# EAGLE design atmega16_generalpurpose_board (EAGLE 7.1.0)
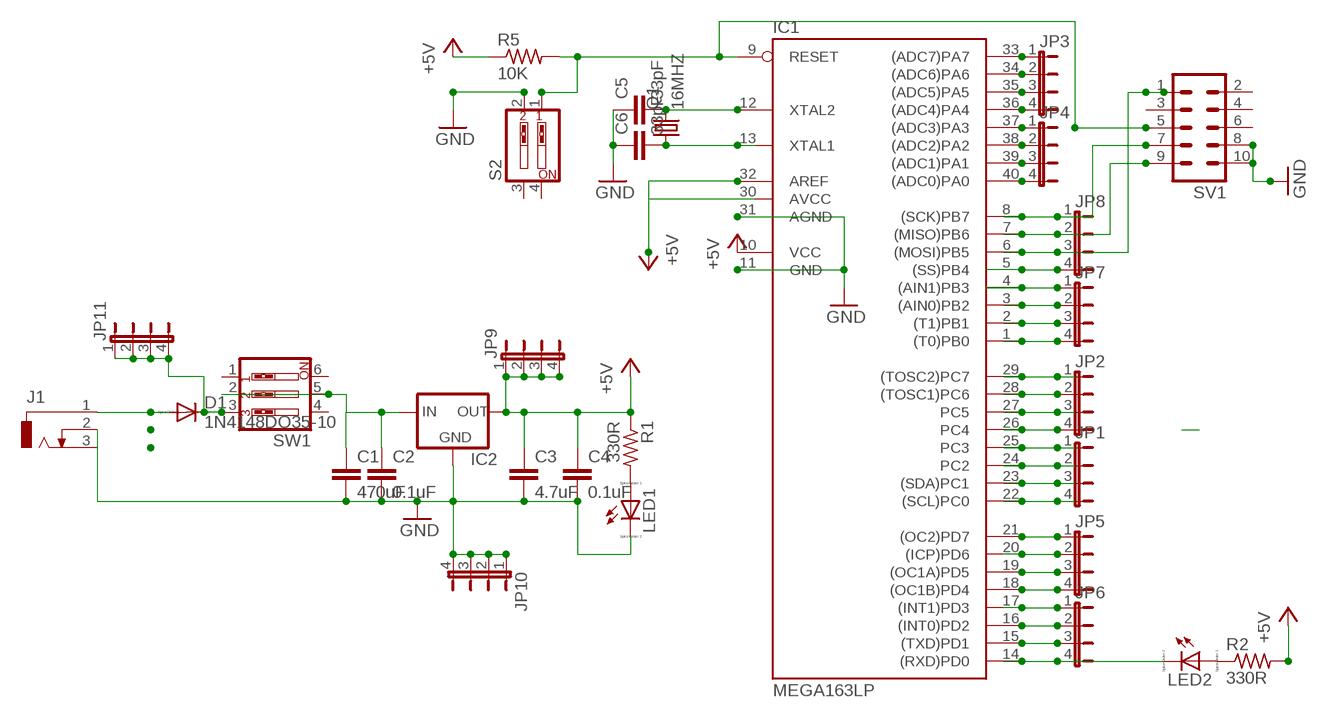
[diagram p0: schematic, sheet 1]

## Parts
C1  470uF  C2.5/4  [C2.5-4]
C2  0.1uF  C2.5/4  [C2.5-4]
C3  4.7uF  C2.5/4  [C2.5-4]
C4  0.1uF  C2.5/4  [C2.5-4]
C5  33pF  C2.5/4  [C2.5-4]
C6  33pF  C2.5/4  [C2.5-4]
D1  1N4148DO35-10  [DO35-10]
IC1  MEGA163LP  [DIL40]
IC2  78XXS  [78XXS]
J1  DCJ0303  [DCJ0303]
JP1  JP4E  [JP4]
JP2  JP4E  [JP4]
JP3  JP4E  [JP4]
JP4  JP4E  [JP4]
JP5  JP4E  [JP4]
JP6  JP4E  [JP4]
JP7  JP4E  [JP4]
JP8  JP4E  [JP4]
JP9  JP4E  [JP4]
JP10  JP4E  [JP4]
JP11  JP4E  [JP4]
LED1  LED_ELD260  [LED_LD260]
LED2  LED_ELD260  [LED_LD260]
Q1  16MHZ  CRYSTALHC49U-V  [HC49U-V]
R1  330R  R-US_0204/7  [0204/7]
R2  330R  R-US_0204/7  [0204/7]
R5  10K  R-US_0204/7  [0204/7]
S2  SW_DIP-2  [EDG-02]
SV1  MA05-2  [MA05-2]
SW1  SW_DIP-3  [EDG-03]

## Nets
+5V: C3.1 C4.1 IC1.10(VCC) IC1.32(AREF) IC2.OUT JP9.1 JP9.2 JP9.3 JP9.4 R1.1 R2.2 R5.1
GND: C1.2 C2.2 C3.2 C4.2 C5.1 C6.1 IC1.11(GND) IC1.31(AGND) IC2.GND J1.2 J1.3 JP10.1 JP10.2 JP10.3 JP10.4 LED1.K(C) S2.2 SV1.8 SV1.10
N$1: D1.A J1.1
N$2: IC1.29((TOSC2)PC7) JP2.1
N$3: C5.2 IC1.12(XTAL2) Q1.2
N$4: C6.2 IC1.13(XTAL1) Q1.1
N$5: LED1.A R1.2
N$6: IC1.9(RESET) R5.2 S2.1 SV1.5
N$7: IC1.21((OC2)PD7) JP5.1
N$8: D1.C JP11.1 JP11.2 JP11.3 JP11.4 SW1.3
N$9: C1.1 C2.1 IC2.IN SW1.2 SW1.5
N$10: IC1.1((T0)PB0) JP7.4
N$11: IC1.2((T1)PB1) JP7.3
N$12: IC1.3((AIN0)PB2) JP7.2
N$13: IC1.4((AIN1)PB3) JP7.1
N$14: IC1.17((INT1)PD3) JP6.1
N$15: IC1.20((ICP)PD6) JP5.2
N$16: IC1.5((SS)PB4) JP8.4
N$17: IC1.28((TOSC1)PC6) JP2.2
N$18: IC1.27(PC5) JP2.3
N$19: IC1.26(PC4) JP2.4
N$20: IC1.25(PC3) JP1.1
N$21: IC1.24(PC2) JP1.2
N$22: IC1.23((SDA)PC1) JP1.3
N$23: IC1.22((SCL)PC0) JP1.4
N$24: IC1.6((MOSI)PB5) JP8.3 SV1.1
N$25: IC1.7((MISO)PB6) JP8.2 SV1.9
N$26: IC1.8((SCK)PB7) JP8.1 SV1.7
N$27: IC1.14((RXD)PD0) JP6.4 LED2.K(C)
N$28: IC1.19((OC1A)PD5) JP5.3
N$29: IC1.33((ADC7)PA7) JP3.1
N$30: IC1.34((ADC6)PA6) JP3.2
N$31: IC1.35((ADC5)PA5) JP3.3
N$32: IC1.36((ADC4)PA4) JP3.4
N$33: IC1.37((ADC3)PA3) JP4.1
N$34: IC1.38((ADC2)PA2) JP4.2
N$35: IC1.39((ADC1)PA1) JP4.3
N$36: IC1.40((ADC0)PA0) JP4.4
N$37: LED2.A R2.1
N$38: IC1.18((OC1B)PD4) JP5.4
N$39: IC1.16((INT0)PD2) JP6.2
N$40: IC1.15((TXD)PD1) JP6.3
Unconnected: S2.3 S2.4 SV1.2 SV1.3 SV1.4 SV1.6 SW1.1 SW1.4 SW1.6

## Power pins joined to a net without a drawn wire
AVCC: IC1.30(AVCC)

## Library data of the parts
C1-C6 = capacitor-wima:C: CAPACITOR naming: grid - package width
D1 = diode:1N4148: DIODE high speed (Philips)
IC1 = atmel:MEGA163*P: MICROCONTROLLER 16 Kbytes FLASH 1 Kbytes EEPROM 1 Kbytes SRAM UART 8-channel 10 bit ADC hardware multiplier Source: avr.lbr; OC_FARNELL: unknown; OC_NEWARK: unknown
IC2 = v-reg:78XXS: VOLTAGE REGULATOR
J1 = con-jack:DCJ0303: DC POWER JACK Source: DCJ0303.pdf; OC_FARNELL: unknown; OC_NEWARK: unknown
JP1-JP11 = jumper:JP4E: JUMPER
LED1 LED2 = eagle-ltspice:LED_E: LED Source: http://www.osram.convergy.de Source: www.luxeon.com Source: www.kingbright.com; SPICEMODEL: NONE; SPICEPREFIX: D; SPICETYPE: diode
Q1 = crystal:CRYSTAL: CRYSTAL; OC_FARNELL: 1666969; OC_NEWARK: unknown
R1 R2 R5 = resistor:R-US_: RESISTOR, American symbol
S2 = special:SW_DIP-2: DIP SWITCH
SV1 = con-lstb:MA05-2: PIN HEADER; OC_FARNELL: unknown; OC_NEWARK: unknown
SW1 = special:SW_DIP-3: DIP SWITCH

## Board
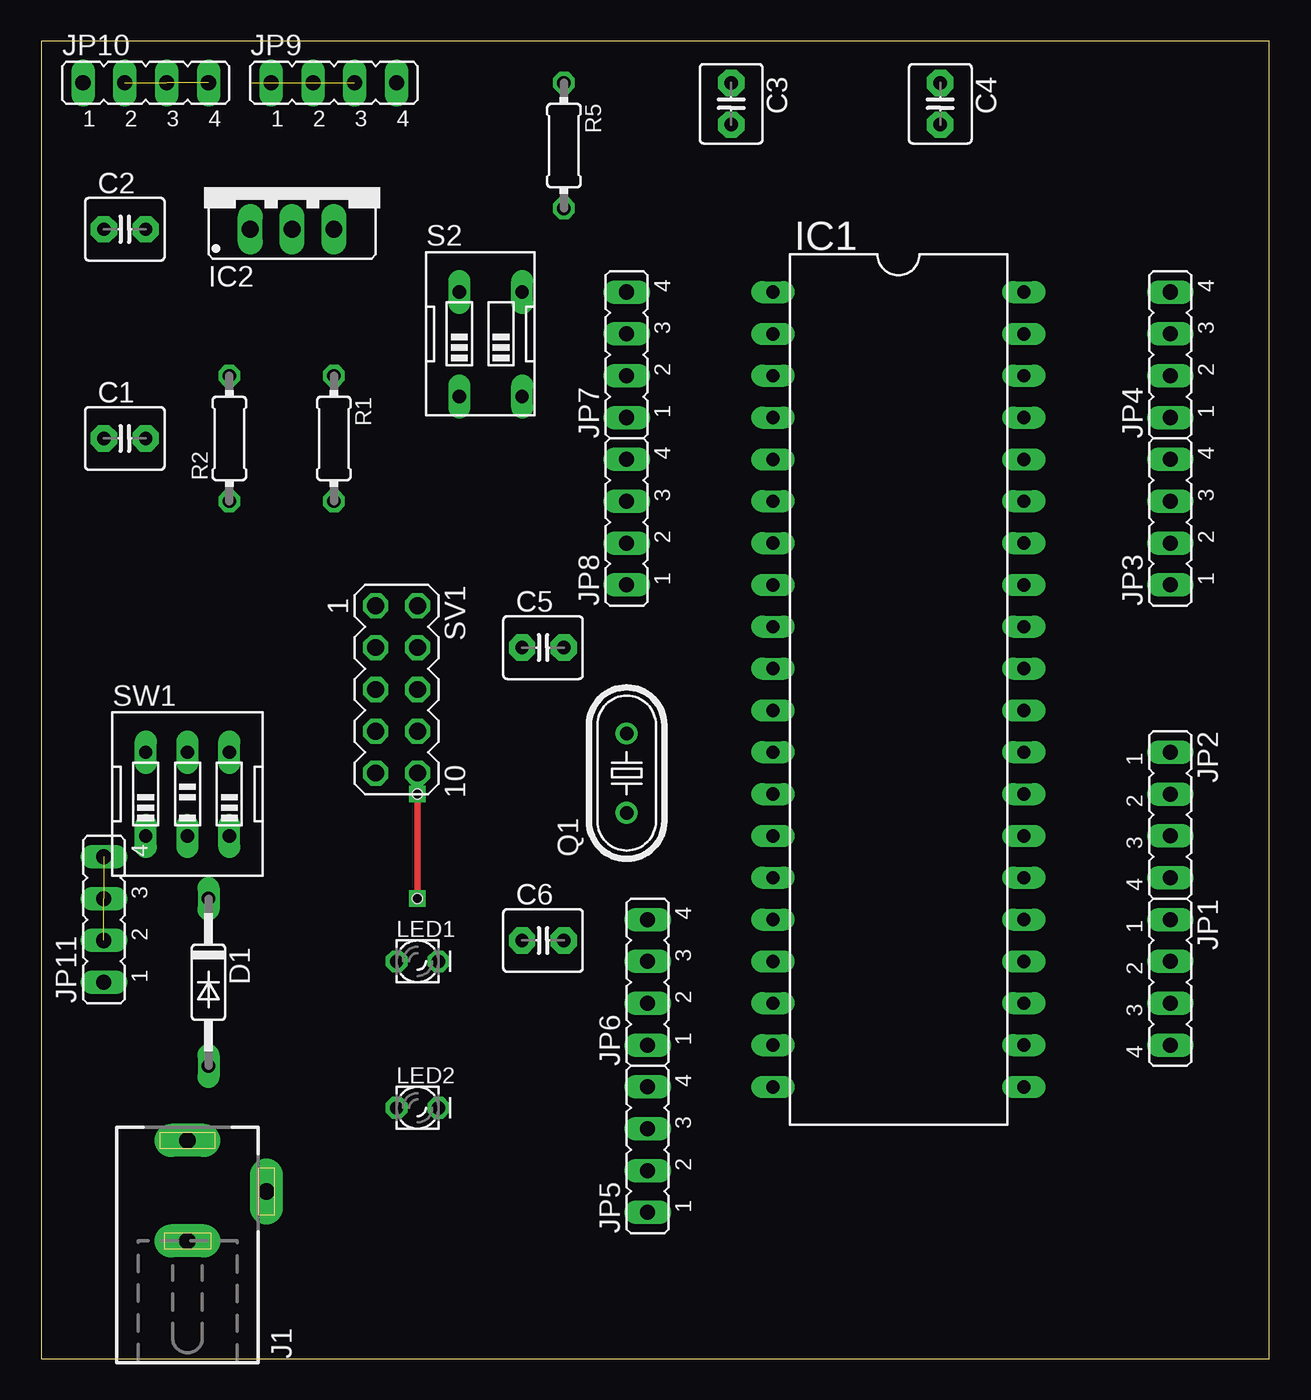
[diagram p1: board, top side]
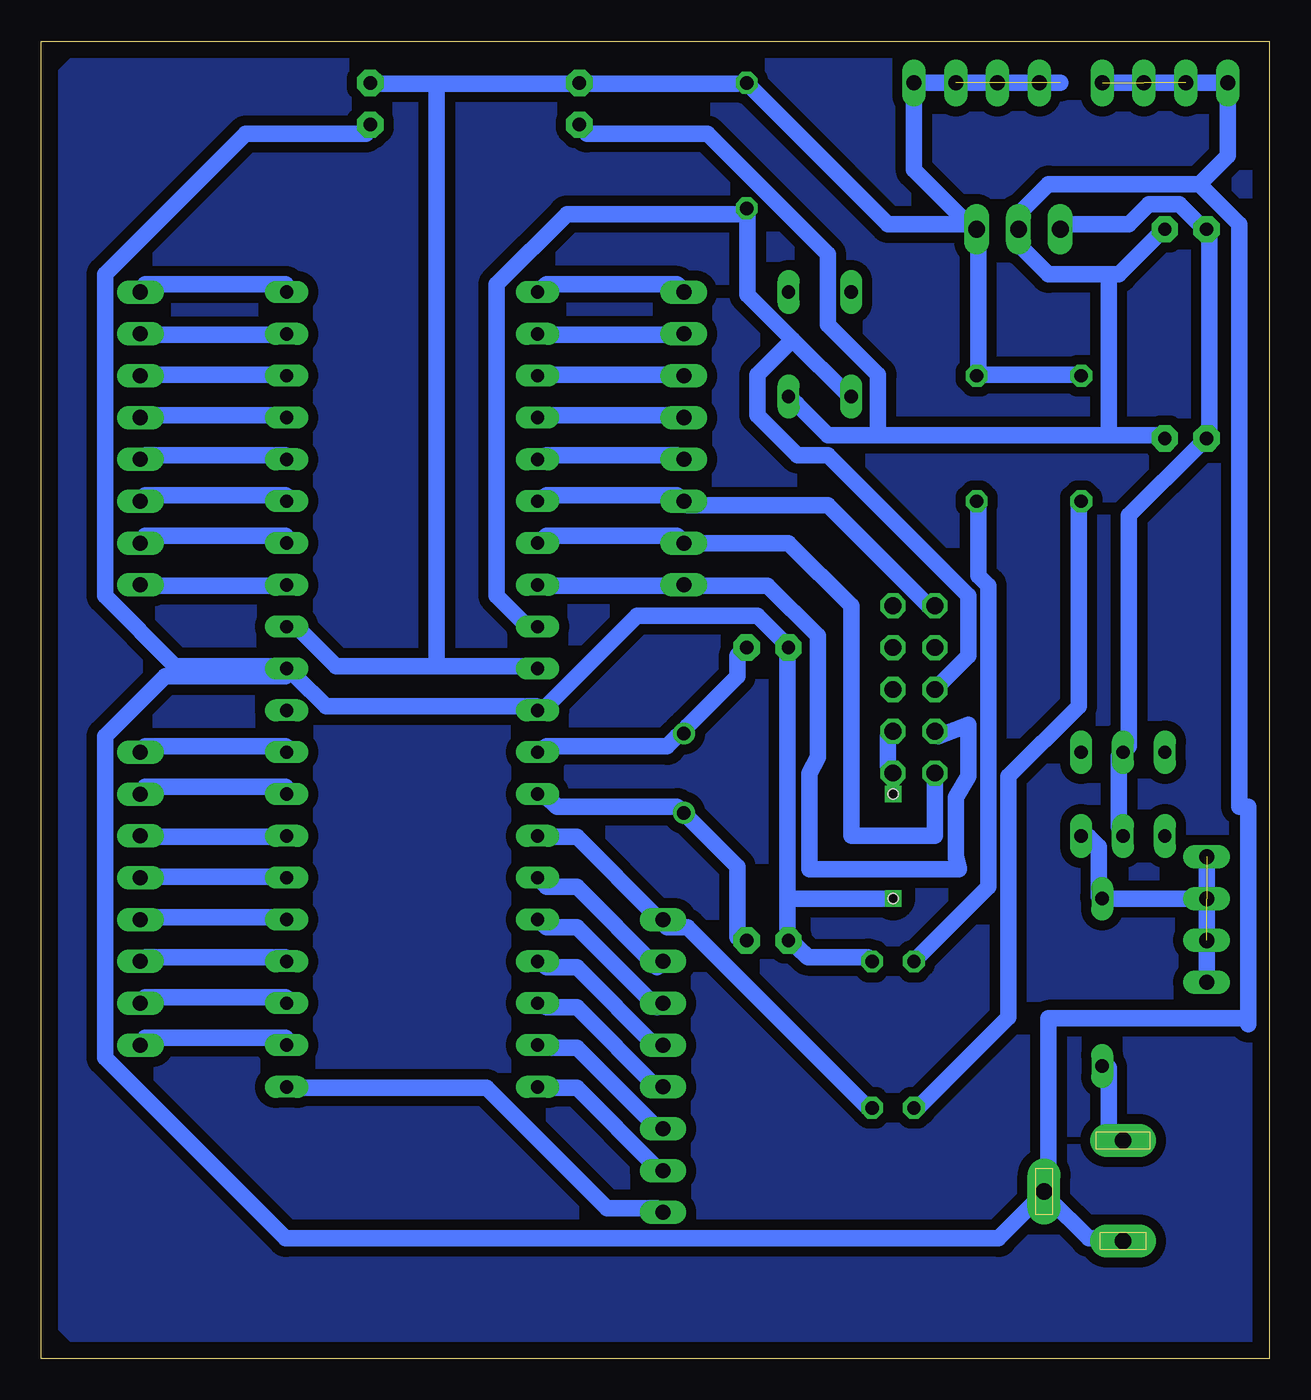
[diagram p2: board, bottom side, seen from below]

Size 74.6 x 80 mm. Coordinates in mm from the lower left corner, seen from the top.
Outline: 0,0 74.6,0 74.6,80 0,80 0,0
Copper layers (1*16): Top 0.035mm / dielectric 1.5mm / Bottom 0.035mm
Design rules "default *": minimum track width 40mil, minimum drill 24mil, track to track 8mil, track to pad 8mil, pad to pad 8mil, via to via 8mil, smd to smd 8mil, copper to edge 40mil, drill to drill 8mil, minimum pad ring 10mil, minimum via ring 8mil, stop-mask expansion 4mil, vias tented up to drill 0mil, thermal gap 10mil
Holes 0.6 mm at 22.86,27.94 22.86,34.29

### Footprints (pad centres in the part's own frame; a part is rotated, then mirrored left to right if it is on the bottom)
C2.5-4 = drill 0.813 pad 1.6 octagon: 1 -1.27,0; 2 1.27,0
DO35-10 = drill 0.813 long: A 5.08,0; C -5.08,0
DIL40 = drill 0.813 long: 1 -24.13,-7.62; 2 -21.59,-7.62; 3 -19.05,-7.62; 4 -16.51,-7.62; 5 -13.97,-7.62; 6 -11.43,-7.62; 7 -8.89,-7.62; 8 -6.35,-7.62; 9 -3.81,-7.62; 10 -1.27,-7.62; 11 1.27,-7.62; 12 3.81,-7.62; 13 6.35,-7.62; 14 8.89,-7.62; 15 11.43,-7.62; 16 13.97,-7.62; 17 16.51,-7.62; 18 19.05,-7.62; 19 21.59,-7.62; 20 24.13,-7.62; 21 24.13,7.62; 22 21.59,7.62; 23 19.05,7.62; 24 16.51,7.62; 25 13.97,7.62; 26 11.43,7.62; 27 8.89,7.62; 28 6.35,7.62; 29 3.81,7.62; 30 1.27,7.62; 31 -1.27,7.62; 32 -3.81,7.62; 33 -6.35,7.62; 34 -8.89,7.62; 35 -11.43,7.62; 36 -13.97,7.62; 37 -16.51,7.62; 38 -19.05,7.62; 39 -21.59,7.62; 40 -24.13,7.62
78XXS = drill 1.016 long: GND 0,-2.54; IN -2.54,-2.54; OUT 2.54,-2.54
DCJ0303 = drill 1 pad 2 long: 1 0,3.1; 2 4.8,0; 3 0,-3
JP4 = drill 0.914 long: 1 -3.81,0; 2 -1.27,0; 3 1.27,0; 4 3.81,0
LED_LD260 = drill 0.813 octagon: A -1.27,0; K 1.27,0
HC49U-V = drill 0.813: 1 -2.413,0; 2 2.413,0
0204/7 = drill 0.813 octagon: 1 -3.81,0; 2 3.81,0
EDG-02 = drill 0.813 long: 1 -1.27,-3.81; 2 2.54,-3.81; 3 2.54,2.54; 4 -1.27,2.54
MA05-2 = drill 1.016 octagon: 1 -5.08,-1.27; 2 -5.08,1.27; 3 -2.54,-1.27; 4 -2.54,1.27; 5 0,-1.27; 6 0,1.27; 7 2.54,-1.27; 8 2.54,1.27; 9 5.08,-1.27; 10 5.08,1.27
EDG-03 = drill 0.813 long: 1 -2.54,-2.54; 2 0,-2.54; 3 2.54,-2.54; 4 2.54,2.54; 5 0,2.54; 6 -2.54,2.54

### Placement (x,y rotation side)
C1  5.08,55.88 0 top
C2  5.08,68.58 0 top
C3  41.91,76.2 270 top
C4  54.61,76.2 270 top
C5  30.48,43.18 0 top
C6  30.48,25.4 0 top
D1  10.16,22.86 270 top
IC1  52.07,40.64 270 top
IC2  15.24,71.12 0 top
J1  8.89,10.16 0 top
JP1  68.58,22.86 270 top
JP2  68.58,33.02 270 top
JP3  68.58,50.8 90 top
JP4  68.58,60.96 90 top
JP5  36.83,12.7 90 top
JP6  36.83,22.86 90 top
JP7  35.56,60.96 90 top
JP8  35.56,50.8 90 top
JP9  17.78,77.47 0 top
JP10  6.35,77.47 0 top
JP11  3.81,26.67 90 top
LED1  22.86,24.13 0 top
LED2  22.86,15.24 0 top
Q1  35.56,35.56 90 top
R1  17.78,55.88 270 top
R2  11.43,55.88 90 top
R5  31.75,73.66 270 top
S2  26.67,62.23 0 top
SV1  21.59,40.64 270 top
SW1  8.89,34.29 0 top

### Tracks (layer width: path | path; a pad name or v marks a point on that pad's centre or on a via)
+5V  (3 unrouted)
  Bottom 1.016: 50.6,42.06 56.69,42.06 59.13,44.5 IC1.32 | 50.6,42.06 44.5,42.06 IC1.10 | 17.68,59.74 11.58,59.74 R2.2 | 17.68,59.74 17.68,68.28 IC2.OUT 18.29,68.89 | 17.68,59.74 R1.1 | 50.6,77.42 42.06,77.42 C3.1 41.45,77.42 32.31,77.42 R5.1 23.16,68.89 18.29,68.89 | 50.6,77.42 54.25,77.42 C4.1 | 50.6,77.42 50.6,42.06 | 18.29,68.89 21.59,72.19 JP9.4 12.7,77.47
GND  (via drill 0.6)  (2 unrouted)
  Top 0.406: v22.86,27.94 v22.86,34.29
  Bottom 0.406: 23.16,37.8 22.86,37.49 v22.86,34.29 | 29.26,33.02 29.21,32.97 29.21,27.94
  Bottom 1.016: SV1.10 23.16,35.97 23.16,37.8 SV1.8 | LED1.K 24.38,24.38 28.04,24.38 28.65,24.99 C6.1 29.26,25.6 29.26,33.02 29.26,42.67 C5.1 29.26,43.28 31.09,45.11 38.41,45.11 43.89,39.62 IC1.11 44.5,39.62 57.3,39.62 59.13,41.45 IC1.31 | C4.2 54.86,74.37 62.18,74.37 70.71,65.84 70.71,46.33 66.45,42.06 59.74,42.06 IC1.31 | J1.3 9.14,7.32 10.97,7.32 13.41,9.75 J1.2 | 9.75,65.84 9.14,65.84 6.71,68.28 C2.2 | 9.75,65.84 13.41,65.84 15.24,67.67 IC2.GND 15.24,69.49 13.41,71.32 4.27,71.32 | 9.75,56.08 6.71,56.08 C1.2 | 9.75,56.08 23.77,56.08 | 23.77,56.08 26.82,56.08 28.65,57.91 S2.2 | 23.77,56.08 23.77,59.74 26.82,62.79 26.82,67.06 34.14,74.37 41.45,74.37 C3.2 | 9.75,56.08 9.75,65.84 | 1.27,20.68 1.27,33.53 1.83,33.53 1.83,68.89 4.27,71.32 | 1.27,20.32 1.27,20.68 | 1.27,20.68 13.41,20.68 13.41,10.36 J1.2 | IC1.31 59.74,41.45 67.06,41.45 70.71,37.8 70.71,18.29 59.74,7.32 16.46,7.32 14.02,9.75 J1.2 | 29.21,27.94 v22.86,27.94 | 4.27,71.32 2.54,73.05 JP10.1 JP10.4
N$1
  Bottom 1.016: D1.A 9.75,17.68 9.75,14.02 9.14,13.41 J1.1
N$2
  Bottom 1.016: IC1.29 59.74,37.19 68.28,37.19 JP2.1
N$3
  Bottom 1.016: IC1.12 43.89,37.19 36.58,37.19 35.97,37.8 Q1.2 35.36,38.41 32.31,41.45 32.31,42.67 C5.2
N$4
  Bottom 1.016: IC1.13 43.89,34.14 43.28,33.53 35.97,33.53 Q1.1 35.36,32.92 32.31,29.87 32.31,25.6 C6.2
N$5
  Bottom 1.016: LED1.A 17.07,28.65 17.07,46.94 17.68,47.55 17.68,51.82 R1.2
N$6
  Bottom 1.016: IC1.9 44.5,44.5 45.11,44.5 46.94,46.33 46.94,65.23 42.67,69.49 32.31,69.49 R5.2 31.7,69.49 31.7,64.62 28.96,61.87 | 28.96,61.87 25.6,58.52 S2.1 | SV1.5 18.29,42.67 18.29,46.33 26.82,54.86 28.65,54.86 31.09,57.3 31.09,59.74 28.96,61.87
N$7
  Bottom 1.016: IC1.21 59.13,16.46 47.55,16.46 40.23,9.14 37.19,9.14 JP5.1
N$8  (2 unrouted)
  Bottom 1.016: SW1.3 10.97,31.7 10.36,31.09 10.36,28.04 D1.C JP11.3 | JP11.4 JP11.1
N$9
  Bottom 1.016: SW1.2 9.14,32.31 9.14,36.58 SW1.5 8.53,37.19 8.53,51.21 4.27,55.47 C1.1 3.66,56.08 3.66,68.28 C2.1 4.27,68.89 5.49,70.1 7.32,70.1 8.53,68.89 12.19,68.89 IC2.IN
N$10
  Bottom 1.016: IC1.1 43.89,65.23 35.97,65.23 JP7.4
N$11
  Bottom 1.016: IC1.2 43.89,62.18 35.97,62.18 JP7.3
N$12
  Bottom 1.016: IC1.3 43.89,59.74 35.97,59.74 JP7.2
N$13
  Bottom 1.016: IC1.4 43.89,57.3 35.97,57.3 JP7.1
N$14
  Bottom 1.016: IC1.17 43.89,23.77 42.06,23.77 37.19,18.9 JP6.1
N$15
  Bottom 1.016: IC1.20 43.89,16.46 42.06,16.46 37.19,11.58 JP5.2
N$16
  Bottom 1.016: IC1.5 43.89,54.86 35.97,54.86 JP8.4
N$17
  Bottom 1.016: IC1.28 59.74,34.75 68.28,34.75 JP2.2
N$18
  Bottom 1.016: IC1.27 59.74,31.7 68.28,31.7 JP2.3
N$19
  Bottom 1.016: IC1.26 59.74,29.26 68.28,29.26 JP2.4
N$20
  Bottom 1.016: IC1.25 59.74,26.82 68.28,26.82 JP1.1
N$21
  Bottom 1.016: IC1.24 59.74,24.38 68.28,24.38 JP1.2
N$22
  Bottom 1.016: IC1.23 59.74,21.95 68.28,21.95 JP1.3
N$23
  Bottom 1.016: IC1.22 59.74,19.51 68.28,19.51 JP1.4
N$24
  Bottom 1.016: IC1.6 43.89,52.43 35.97,52.43 JP8.3 35.36,51.82 26.82,51.82 20.73,45.72 SV1.1
N$25
  Bottom 1.016: IC1.7 43.89,49.99 35.97,49.99 JP8.2 29.21,49.53 25.4,45.72 25.4,31.75 20.32,31.75 SV1.9
N$26
  Bottom 1.016: IC1.8 43.89,46.94 35.97,46.94 JP8.1 35.36,46.94 30.48,46.94 27.43,43.89 27.43,36.52 27.94,35.56 27.94,29.72 18.85,29.72 19.05,30.48 19.05,34.09 18.29,35.36 18.29,38.51 20.12,37.8 SV1.7
N$27
  Bottom 1.016: LED2.K 24.38,15.24 35.36,26.21 36.58,26.21 JP6.4 37.19,26.82 42.06,31.7 43.89,31.7 IC1.14
N$28
  Bottom 1.016: IC1.19 43.89,18.9 42.06,18.9 37.19,14.02 JP5.3
N$29
  Bottom 1.016: IC1.33 59.74,46.94 68.28,46.94 JP3.1
N$30
  Bottom 1.016: IC1.34 59.74,49.99 68.28,49.99 JP3.2
N$31
  Bottom 1.016: IC1.35 59.74,52.43 68.28,52.43 JP3.3
N$32
  Bottom 1.016: IC1.36 59.74,54.86 68.28,54.86 JP3.4
N$33
  Bottom 1.016: IC1.37 59.74,57.3 68.28,57.3 JP4.1
N$34
  Bottom 1.016: IC1.38 59.74,59.74 68.28,59.74 JP4.2
N$35
  Bottom 1.016: IC1.39 59.74,62.18 68.28,62.18 JP4.3
N$36
  Bottom 1.016: IC1.40 59.74,65.23 68.28,65.23 JP4.4
N$37
  Bottom 1.016: R2.1 11.58,51.82 11.58,39.62 15.85,35.36 15.85,20.73 21.34,15.24 LED2.A
N$38
  Bottom 1.016: IC1.18 43.89,21.34 42.06,21.34 37.19,16.46 JP5.4
N$39
  Bottom 1.016: IC1.16 43.89,26.21 42.06,26.21 37.19,21.34 JP6.2
N$40
  Bottom 1.016: IC1.15 43.89,28.65 42.06,28.65 37.19,23.77 JP6.3
N$41
  pour Bottom (isolate 0.61): 2.54,0 0,2.54 0,78.74 1.27,80.01 71.12,80.01 74.93,76.2 74.93,3.81 71.12,0